# EAGLE design hermesONE Mini (EAGLE 9.4.2)
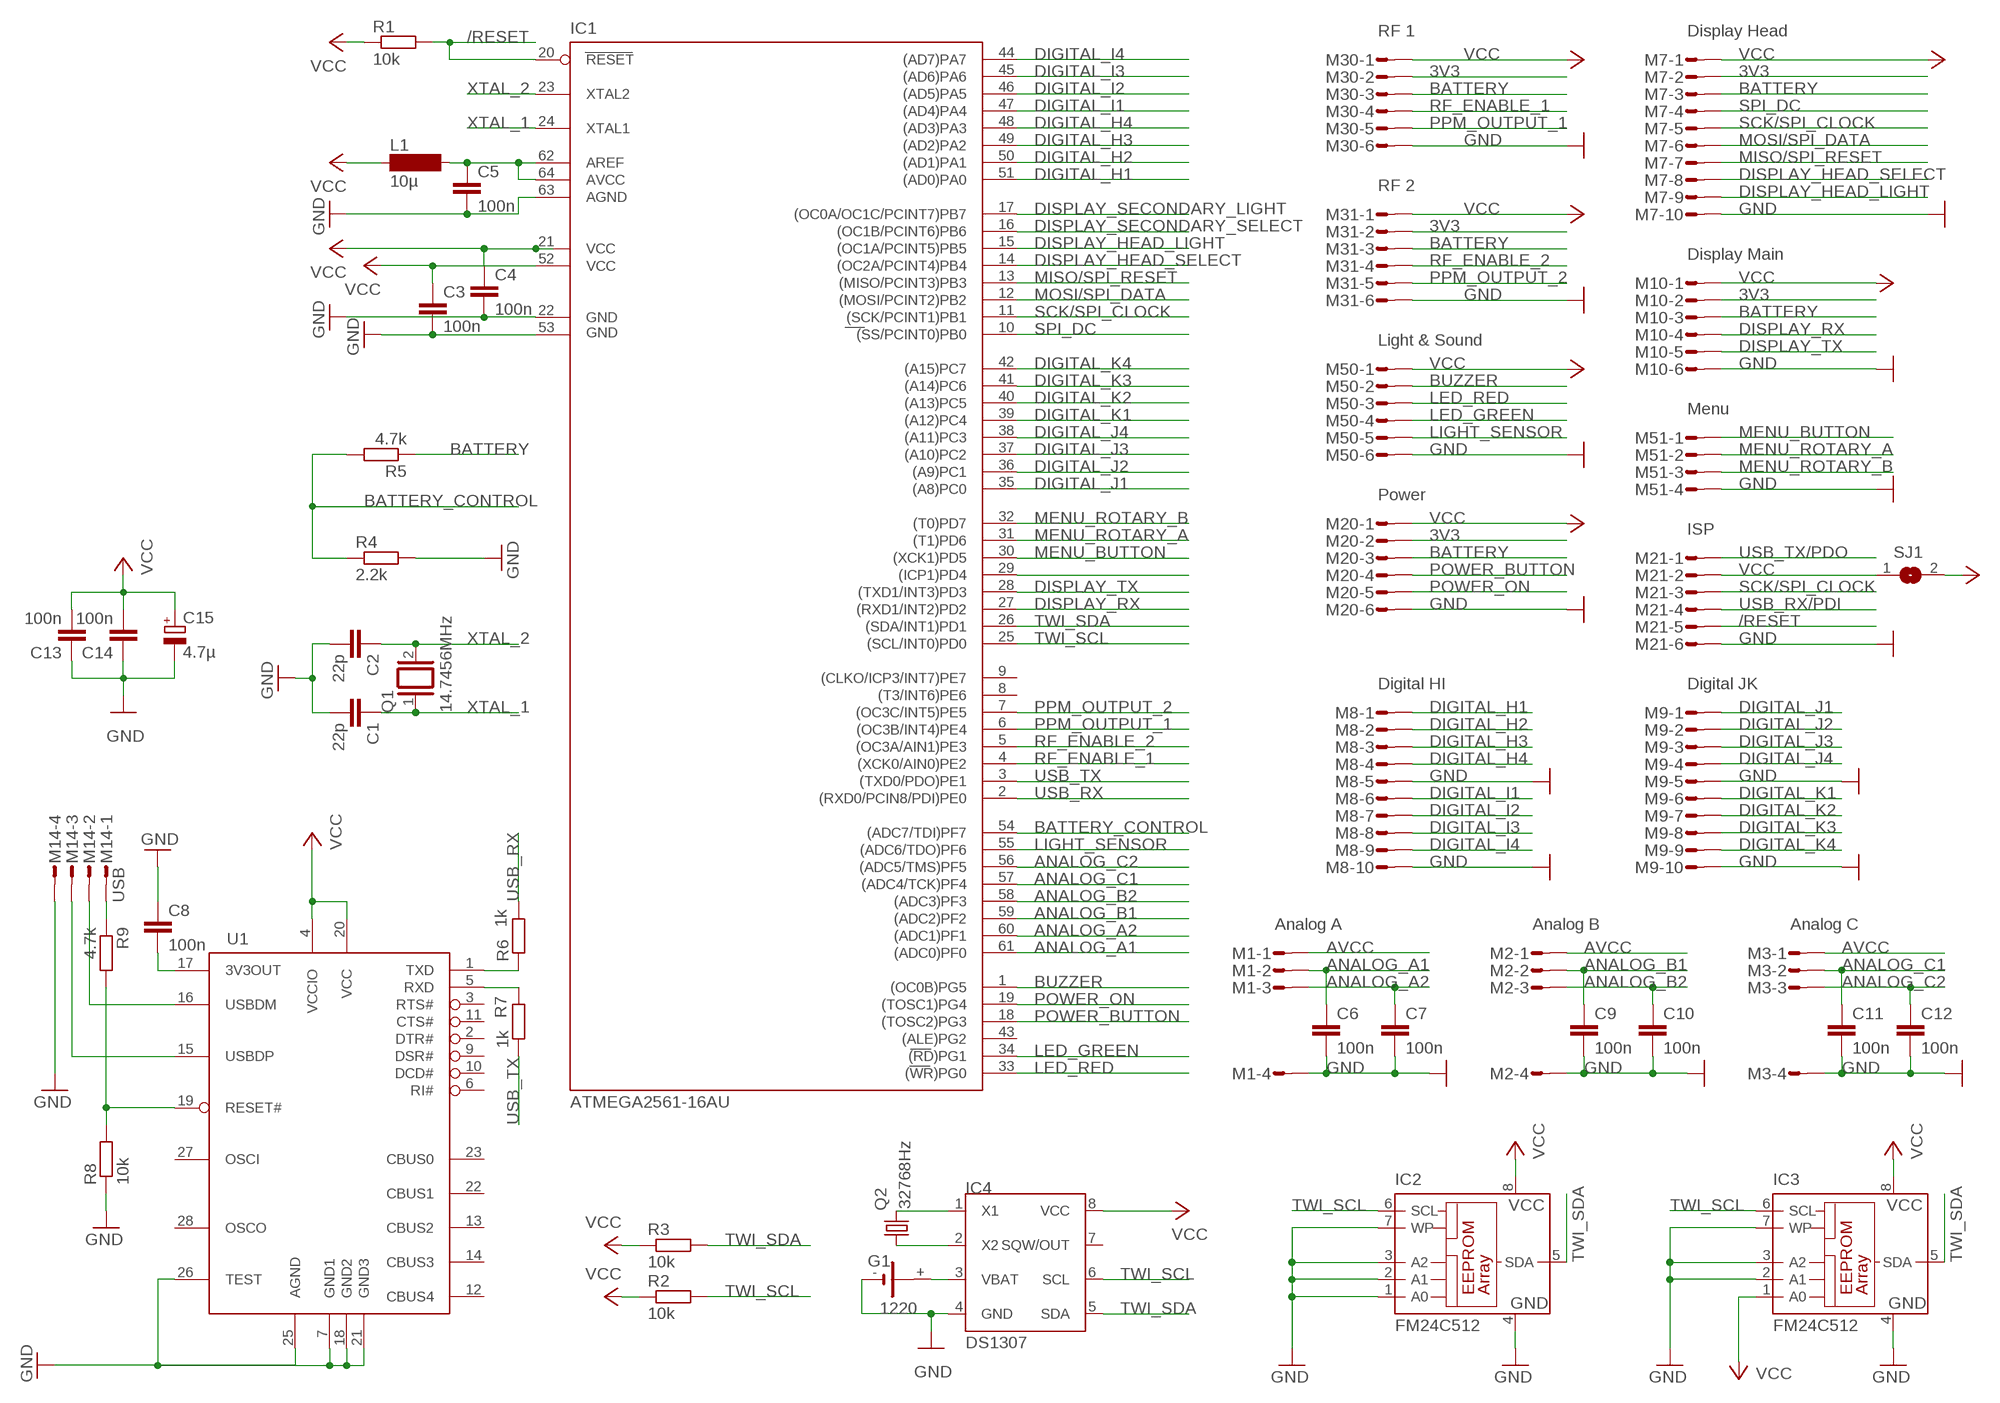
[diagram p0: schematic, sheet 1]

## Parts
C1  22p  C-EUC0603  [C0603]
C2  22p  C-EUC0603  [C0603]
C3  100n  C-EUC0603  [C0603]
C4  100n  C-EUC0603  [C0603]
C5  100n  C-EUC0603  [C0603]
C6  100n  C-EUC0603  [C0603]
C7  100n  C-EUC0603  [C0603]
C8  100n  C-EUC0603  [C0603]
C9  100n  C-EUC0603  [C0603]
C10  100n  C-EUC0603  [C0603]
C11  100n  C-EUC0603  [C0603]
C12  100n  C-EUC0603  [C0603]
C13  100n  C-EUC0603  [C0603]
C14  100n  C-EUC0603  [C0603]
C15  4.7µ  CPOL-EUB  [PANASONIC_B]
G1  1220  [KZH12THM]
IC1  ATMEGA2561-16AU  [TQFP64]
IC2  FM24C512  24C64SM  [SO-08M]
IC3  FM24C512  24C64SM  [SO-08M]
IC4  DS1307  [SOIC-8]
L1  10µ  SM-1206  [SM-1206]
M1  Analog A  MT-4  [MT-4]
M2  Analog B  MT-4  [MT-4]
M3  Analog C  MT-4  [MT-4]
M7  Display Head  MT-10  [MT-10]
M8  Digital HI  MT-10  [MT-10]
M9  Digital JK  MT-10  [MT-10]
M10  Display Main  MT-6  [MT-6]
M14  USB  MT-4  [MT-4]
M20  Power  MT-6  [MT-6]
M21  ISP  MT-6  [MT-6]
M30  RF 1  MT-6  [MT-6]
M31  RF 2  MT-6  [MT-6]
M50  Light & Sound  MT-6  [MT-6]
M51  Menu  MT-4  [MT-4]
Q1  14.7456MHz  XTAL/S  [QS]
Q2  32768Hz  CRYSTALTC26H  [TC26H]
R1  10k  R-EU_R0603  [R0603]
R2  10k  R-EU_R0603  [R0603]
R3  10k  R-EU_R0603  [R0603]
R4  2.2k  R-EU_R0603  [R0603]
R5  4.7k  R-EU_R0603  [R0603]
R6  1k  R-EU_R0603  [R0603]
R7  1k  R-EU_R0603  [R0603]
R8  10k  R-EU_R0603  [R0603]
R9  4.7k  R-EU_R0603  [R0603]
SJ1  SJ  [SJ]
U1  FT232RL  [SSOP28DB]

## Nets
3V3: M7.2 M10.2 M20.2 M30.2 M31.2
/RESET: IC1.20(RESET) M21.5 R1.2
ANALOG_A1: C6.1 IC1.61((ADC0)PF0) M1.2
ANALOG_A2: C7.1 IC1.60((ADC1)PF1) M1.3
ANALOG_B1: C9.1 IC1.59((ADC2)PF2) M2.2
ANALOG_B2: C10.1 IC1.58((ADC3)PF3) M2.3
ANALOG_C1: C11.1 IC1.57((ADC4/TCK)PF4) M3.2
ANALOG_C2: C12.1 IC1.56((ADC5/TMS)PF5) M3.3
AVCC: M1.1 M2.1 M3.1
BATTERY: M7.3 M10.3 M20.3 M30.3 M31.3 R5.1
BATTERY_CONTROL: IC1.54((ADC7/TDI)PF7) R4.1 R5.2
BUZZER: IC1.1((OC0B)PG5) M50.2
DIGITAL_H1: IC1.51((AD0)PA0) M8.1
DIGITAL_H2: IC1.50((AD1)PA1) M8.2
DIGITAL_H3: IC1.49((AD2)PA2) M8.3
DIGITAL_H4: IC1.48((AD3)PA3) M8.4
DIGITAL_I1: IC1.47((AD4)PA4) M8.6
DIGITAL_I2: IC1.46((AD5)PA5) M8.7
DIGITAL_I3: IC1.45((AD6)PA6) M8.8
DIGITAL_I4: IC1.44((AD7)PA7) M8.9
DIGITAL_J1: IC1.35((A8)PC0) M9.1
DIGITAL_J2: IC1.36((A9)PC1) M9.2
DIGITAL_J3: IC1.37((A10)PC2) M9.3
DIGITAL_J4: IC1.38((A11)PC3) M9.4
DIGITAL_K1: IC1.39((A12)PC4) M9.6
DIGITAL_K2: IC1.40((A13)PC5) M9.7
DIGITAL_K3: IC1.41((A14)PC6) M9.8
DIGITAL_K4: IC1.42((A15)PC7) M9.9
DISPLAY_HEAD_LIGHT: IC1.15((OC1A/PCINT5)PB5) M7.9
DISPLAY_HEAD_SELECT: IC1.14((OC2A/PCINT4)PB4) M7.8
DISPLAY_RX: IC1.27((RXD1/INT2)PD2) M10.4
DISPLAY_SECONDARY_LIGHT: IC1.17((OC0A/OC1C/PCINT7)PB7)
DISPLAY_SECONDARY_SELECT: IC1.16((OC1B/PCINT6)PB6)
DISPLAY_TX: IC1.28((TXD1/INT3)PD3) M10.5
GND: C1.2 C2.2 C3.2 C4.2 C5.2 C6.2 C7.2 C8.1 C9.2 C10.2 C11.2 C12.2 C13.1 C14.1 C15.- G1.- IC1.22(GND) IC1.53(GND1) IC1.63(AGND) IC2.1(A0) IC2.2(A1) IC2.3(A2) IC2.4(GND) IC2.7(WP) IC3.2(A1) IC3.3(A2) IC3.4(GND) IC3.7(WP) IC4.4(GND) M1.4 M2.4 M3.4 M7.10 M8.5 M8.10 M9.5 M9.10 M10.6 M14.4 M20.6 M21.6 M30.6 M31.6 M50.6 M51.4 R4.2 R8.1 U1.7(GND1) U1.18(GND2) U1.21(GND3) U1.25(AGND) U1.26(TEST)
LED_GREEN: IC1.34((RD)PG1) M50.4
LED_RED: IC1.33((WR)PG0) M50.3
LIGHT_SENSOR: IC1.55((ADC6/TDO)PF6) M50.5
MENU_BUTTON: IC1.30((XCK1)PD5) M51.1
MENU_ROTARY_A: IC1.31((T1)PD6) M51.2
MENU_ROTARY_B: IC1.32((T0)PD7) M51.3
MISO/SPI_RESET: IC1.13((MISO/PCINT3)PB3) M7.7
MOSI/SPI_DATA: IC1.12((MOSI/PCINT2)PB2) M7.6
N$1: M14.3 U1.15(USBDP)
N$2: G1.+ IC4.3(VBAT)
N$3: IC4.2(X2) Q2.1
N$4: M14.2 U1.16(USBDM)
N$5: C5.1 IC1.62(AREF) IC1.64(AVCC) L1.2
N$6: IC4.1(X1) Q2.2
N$7: M21.2 SJ1.1
N$8: R6.1 U1.1(TXD)
N$9: R7.1 U1.5(RXD)
N$10: M14.1 R9.1
N$11: R8.2 R9.2 U1.19(RESET#)
N$56: C8.2 U1.17(3V3OUT)
POWER_BUTTON: IC1.18((TOSC2)PG3) M20.4
POWER_ON: IC1.19((TOSC1)PG4) M20.5
PPM_INPUT: IC1.29((ICP1)PD4)
PPM_OUTPUT_1: IC1.6((OC3B/INT4)PE4) M30.5
PPM_OUTPUT_2: IC1.7((OC3C/INT5)PE5) M31.5
RF_ENABLE_1: IC1.4((XCK0/AIN0)PE2) M30.4
RF_ENABLE_2: IC1.5((OC3A/AIN1)PE3) M31.4
SCK/SPI_CLOCK: IC1.11((SCK/PCINT1)PB1) M7.5 M21.3
SPI_DC: IC1.10((SS/PCINT0)PB0) M7.4
TWI_SCL: IC1.25((SCL/INT0)PD0) IC2.6(SCL) IC3.6(SCL) IC4.6(SCL) R2.2
TWI_SDA: IC1.26((SDA/INT1)PD1) IC2.5(SDA) IC3.5(SDA) IC4.5(SDA) R3.2
USB_RX: IC1.2((RXD0/PCIN8/PDI)PE0) R6.2
USB_RX/PDI: M21.4
USB_TX: IC1.3((TXD0/PDO)PE1) R7.2
USB_TX/PDO: M21.1
VCC: C3.1 C4.1 C13.2 C14.2 C15.+ IC1.21(VCC) IC1.52(VCC1) IC2.8(VCC) IC3.1(A0) IC3.8(VCC) IC4.8(VCC) L1.1 M7.1 M10.1 M20.1 M30.1 M31.1 M50.1 R1.1 R2.1 R3.1 SJ1.2 U1.4(VCCIO) U1.20(VCC)
XTAL_1: C1.1 IC1.24(XTAL1) Q1.1
XTAL_2: C2.1 IC1.23(XTAL2) Q1.2
Unconnected: IC1.8((T3/INT6)PE6) IC1.9((CLKO/ICP3/INT7)PE7) IC1.43((ALE)PG2) IC4.7(SQW/OUT) U1.2(DTR#) U1.3(RTS#) U1.6(RI#) U1.9(DSR#) U1.10(DCD#) U1.11(CTS#) U1.12(CBUS4) U1.13(CBUS2) U1.14(CBUS3) U1.22(CBUS1) U1.23(CBUS0) U1.27(OSCI) U1.28(OSCO)

## Library data of the parts
C1-C14 = rcl:C-EU: CAPACITOR, European symbol; SPICEPREFIX: C
C15 = rcl:CPOL-EU: POLARIZED CAPACITOR, European symbol; SPICEPREFIX: C
G1 = kzh12_lithium_batterie_holder:1220
IC1 = atmel-2005:ATMEGA2561*: MICROCONTROLLER 256 Kbytes FLASH 4 Kbytes EEPROM 8 Kbytes SRAM 54 General Purpose I/O pins 6-channels 16-bit PWM 2 x Serial USARTs 8-channels 10-bit A/D
IC2 IC3 = microchip:24*: Serial EEPROM I2C
IC4 = dallas:DS1307: I2C Serial RTC w/56 bytes battery backed RAM
L1 = inductor-neosid:SM-1206: INDUCTOR SMD chip inductor
M1-M3 M14 M51 = pst-con-amp-micromatch:MT-4: MT 4 7-215079-4 / 0-215079-4; MPN: 7-215079-4
M7-M9 = pst-con-amp-micromatch:MT-10: MT 10 8-215079-0 / 1-215079-0; MF: FARNELL; MPN: 8-215079-0
M10 M20 M21 M30 M31 M50 = pst-con-amp-micromatch:MT-6: MT 6 7-215079-6 / 0-215079-6; MPN: 7-215079-6
Q1 = special:XTAL/S: CRYSTAL
Q2 = crystal:CRYSTAL: CRYSTAL
R1-R9 = rcl:R-EU_: RESISTOR, European symbol; SPICEPREFIX: R
SJ1 = jumper:SJ: SMD solder JUMPER
U1 = ftdichip-5:FT232RL: USB UART 4th Generation USB UART (USB <-> Serial) Controller

## Net classes
0 default: width 0.254 mm

## Board
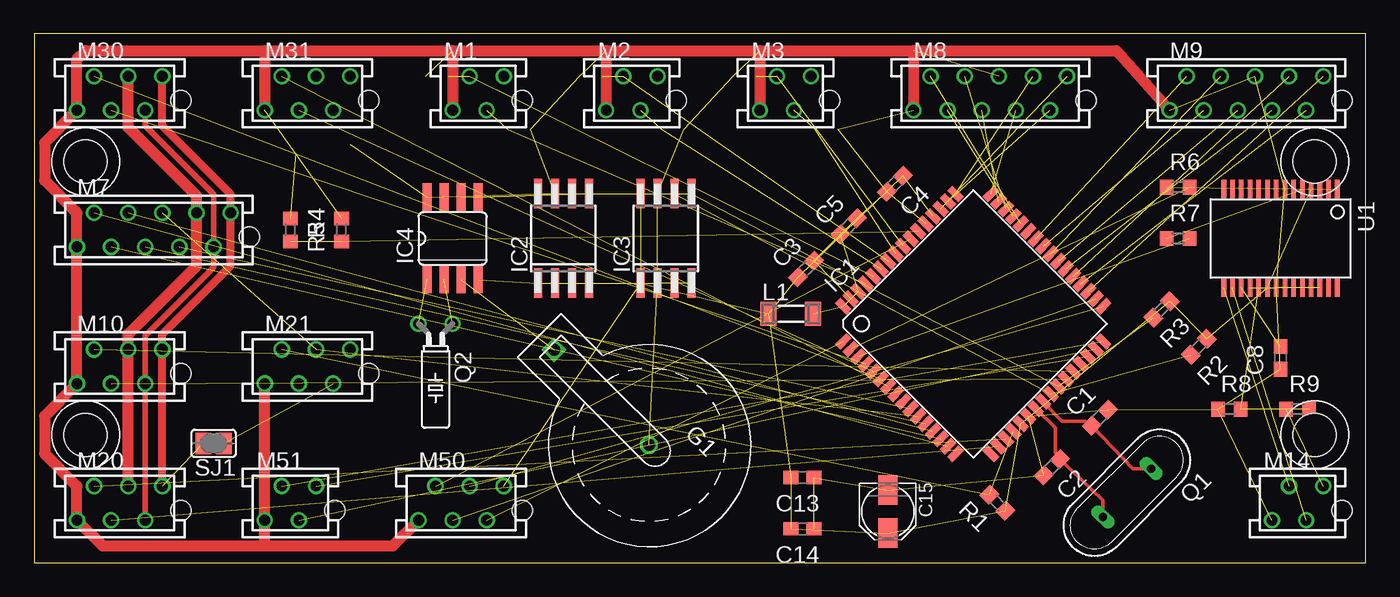
[diagram p1: board, top side]
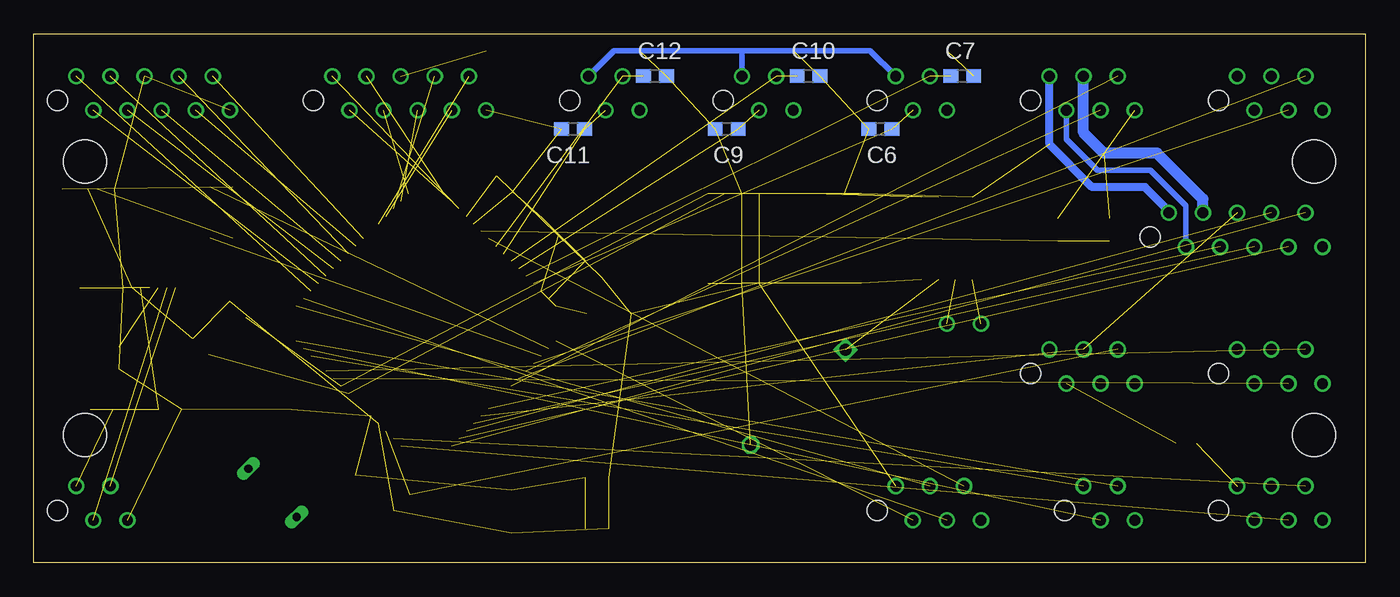
[diagram p2: board, bottom side, seen from below]

Size 99.06 x 39.36 mm. Coordinates in mm from the lower left corner, seen from the top.
Outline: 0,0 99.06,0 99.06,39.36 0,39.36 0,0
Copper layers (1*16): Top 0.035mm / dielectric 1.5mm / Bottom 0.035mm
Design rules "PCB-POOL Standard": minimum track width 0.15mm, minimum drill 0.3mm, track to track 0.15mm, track to pad 0.15mm, pad to pad 0.15mm, via to via 0.15mm, smd to smd 0.15mm, copper to edge 0.3mm, drill to drill 0.2mm, minimum pad ring 0.2mm, minimum via ring 0.15mm, stop-mask expansion 0.075mm, vias tented up to drill 0mil, thermal gap 0.2mm
Holes 3.2 mm at 3.81,9.53 95.25,9.53 95.25,29.84 3.81,29.84

### Footprints (pad centres in the part's own frame; a part is rotated, then mirrored left to right if it is on the bottom)
C0603 = smd 1.1 x 1: 1 -0.85,0; 2 0.85,0
PANASONIC_B = smd 2.2 x 1.4: + 1.6,0; - -1.6,0
KZH12THM = drill 0.9 square: + 9.982,0 | drill 0.9 octagon: - 0,0
TQFP64 = smd 1.194 x 0.559: 1 -7.76,5.905; 2 -7.76,5.118; 3 -7.76,4.331; 4 -7.76,3.543; 5 -7.76,2.756; 6 -7.76,1.968; 7 -7.76,1.181; 8 -7.76,0.394; 9 -7.76,-0.394; 10 -7.76,-1.181; 11 -7.76,-1.968; 12 -7.76,-2.756; 13 -7.76,-3.543; 14 -7.76,-4.331; 15 -7.76,-5.118; 16 -7.76,-5.905; 33 7.76,-5.905; 34 7.76,-5.118; 35 7.76,-4.331; 36 7.76,-3.543; 37 7.76,-2.756; 38 7.76,-1.968; 39 7.76,-1.181; 40 7.76,-0.394; 41 7.76,0.394; 42 7.76,1.181; 43 7.76,1.968; 44 7.76,2.756; 45 7.76,3.543; 46 7.76,4.331; 47 7.76,5.118; 48 7.76,5.905 | smd 0.559 x 1.194: 17 -5.905,-7.76; 18 -5.118,-7.76; 19 -4.331,-7.76; 20 -3.543,-7.76; 21 -2.756,-7.76; 22 -1.968,-7.76; 23 -1.181,-7.76; 24 -0.394,-7.76; 25 0.394,-7.76; 26 1.181,-7.76; 27 1.968,-7.76; 28 2.756,-7.76; 29 3.543,-7.76; 30 4.331,-7.76; 31 5.118,-7.76; 32 5.905,-7.76; 49 5.905,7.76; 50 5.118,7.76; 51 4.331,7.76; 52 3.543,7.76; 53 2.756,7.76; 54 1.968,7.76; 55 1.181,7.76; 56 0.394,7.76; 57 -0.394,7.76; 58 -1.181,7.76; 59 -1.968,7.76; 60 -2.756,7.76; 61 -3.543,7.76; 62 -4.331,7.76; 63 -5.118,7.76; 64 -5.905,7.76
SO-08M = smd 0.6 x 2.2: 1 -1.905,-3.33; 2 -0.635,-3.33; 3 0.635,-3.33; 4 1.905,-3.33; 5 1.905,3.33; 6 0.635,3.33; 7 -0.635,3.33; 8 -1.905,3.33
SOIC-8 = smd 2.032 x 0.66: 1 -3.073,1.27; 2 -3.073,0; 3 -3.073,-1.27; 4 -3.073,-2.54; 5 3.073,-2.54; 6 3.073,-1.27; 7 3.073,0; 8 3.073,1.27
SM-1206 = smd 1.2 x 1.8: 1 -1.65,0; 2 1.65,0
MT-4 = drill 0.8: 1 1.905,1.27; 2 0.635,-1.27; 3 -0.635,1.27; 4 -1.905,-1.27 | hole 1.5: 3.302,-0.533
MT-10 = drill 0.813: 1 5.715,1.27; 2 4.445,-1.27; 3 3.175,1.27; 4 1.905,-1.27; 5 0.635,1.27; 6 -0.635,-1.27; 7 -1.905,1.27; 8 -3.175,-1.27; 9 -4.445,1.27; 10 -5.715,-1.27 | hole 1.5: 7.112,-0.533
MT-6 = drill 0.813: 1 3.175,1.27; 2 1.905,-1.27; 3 0.635,1.27; 4 -0.635,-1.27; 5 -1.905,1.27; 6 -3.175,-1.27 | hole 1.5: 4.572,-0.533
QS = drill 0.61 long: 1 -2.54,0; 2 2.54,0
TC26H = drill 0.813: 1 -1.27,0; 2 1.27,0
R0603 = smd 1 x 1.1: 1 -0.85,0; 2 0.85,0
SJ = smd 1.168 x 1.6: 1 -0.762,0; 2 0.762,0
SSOP28DB = smd 0.348 x 1.397: 1 -4.225,-3.656; 2 -3.575,-3.656; 3 -2.925,-3.656; 4 -2.275,-3.656; 5 -1.625,-3.656; 6 -0.975,-3.656; 7 -0.325,-3.656; 8 0.325,-3.656; 9 0.975,-3.656; 10 1.625,-3.656; 11 2.275,-3.656; 12 2.925,-3.656; 13 3.575,-3.656; 14 4.225,-3.656; 15 4.225,3.656; 16 3.575,3.656; 17 2.925,3.656; 18 2.275,3.656; 19 1.625,3.656; 20 0.975,3.656; 21 0.325,3.656; 22 -0.325,3.656; 23 -0.975,3.656; 24 -1.625,3.656; 25 -2.275,3.656; 26 -2.925,3.656; 27 -3.575,3.656; 28 -4.225,3.656

### Placement (x,y rotation side)
C1  79.26,10.8 45 top
C2  75.7,7.12 225 top
C3  57.41,21.85 45 top
C4  64.03,28.2 225 top
C5  60.59,25.03 45 top
C6  36.07,32.26 180 bottom
C7  29.97,36.2 0 bottom
C8  92.71,15.24 90 top
C9  47.5,32.26 180 bottom
C10  41.4,36.2 0 bottom
C11  58.93,32.26 180 bottom
C12  52.83,36.2 0 bottom
C13  57.15,6.35 180 top
C14  57.15,2.54 180 top
C15  63.5,3.81 270 top
G1  45.72,8.78 135 top
IC1  69.85,17.78 45 top
IC2  39.37,24.13 0 top
IC3  46.99,24.13 0 top
IC4  30.48,24.13 90 top
L1  56.28,18.53 0 top
M1  33.02,34.92 0 top
M2  44.45,34.92 0 top
M3  55.88,34.92 0 top
M7  8.89,24.77 0 top
M8  71.12,34.92 0 top
M9  90.17,34.92 0 top
M10  6.35,14.61 0 top
M14  93.98,4.45 0 top
M20  6.35,4.45 0 top
M21  20.32,14.61 0 top
M30  6.35,34.92 0 top
M31  20.32,34.92 0 top
M50  31.75,4.45 0 top
M51  19.05,4.45 0 top
Q1  81.29,5.22 225 top
Q2  29.84,17.78 180 top
R1  71.65,4.46 135 top
R2  86.63,16.07 225 top
R3  83.86,18.85 225 top
R4  22.86,24.77 90 top
R5  19.05,24.77 270 top
R6  85.09,27.94 0 top
R7  85.09,24.13 0 top
R8  88.9,11.43 0 top
R9  93.98,11.43 0 top
SJ1  13.34,8.89 180 top
U1  92.71,24.13 180 top

### Tracks (layer width: path | path; a pad name or v marks a point on that pad's centre or on a via)
3V3
  Top 0.406: M20.2 M10.2 8.26,16.89 13.34,21.97 M7.2 13.34,27.43 8.26,32.51 M30.2
  Bottom 0.406: M31.2 22.23,31.5 19.94,29.21 16,29.21 13.34,26.54 M7.2
/RESET  (2 unrouted)
ANALOG_A1  (2 unrouted)
ANALOG_A2  (2 unrouted)
ANALOG_B1  (2 unrouted)
ANALOG_B2  (2 unrouted)
ANALOG_C1  (2 unrouted)
ANALOG_C2  (2 unrouted)
AVCC
  Bottom 0.406: M1.1 36.83,38.1 46.23,38.1 | 46.23,38.1 55.88,38.1 M3.1 | M2.1 46.35,37.97 46.23,38.1
BATTERY  (1 unrouted)
  Top 0.813: M20.3 M10.3 6.99,17.02 12.06,22.1 M7.3 12.06,27.3 6.99,32.38 M30.3
  Bottom 0.813: M7.3 12.06,27.05 15.49,30.48 19.43,30.48 20.95,32 M31.3
BATTERY_CONTROL  (2 unrouted)
BUZZER  (1 unrouted)
DIGITAL_H1  (1 unrouted)
DIGITAL_H2  (1 unrouted)
DIGITAL_H3  (1 unrouted)
DIGITAL_H4  (1 unrouted)
DIGITAL_I1  (1 unrouted)
DIGITAL_I2  (1 unrouted)
DIGITAL_I3  (1 unrouted)
DIGITAL_I4  (1 unrouted)
DIGITAL_J1  (1 unrouted)
DIGITAL_J2  (1 unrouted)
DIGITAL_J3  (1 unrouted)
DIGITAL_J4  (1 unrouted)
DIGITAL_K1  (1 unrouted)
DIGITAL_K2  (1 unrouted)
DIGITAL_K3  (1 unrouted)
DIGITAL_K4  (1 unrouted)
DISPLAY_HEAD_LIGHT  (1 unrouted)
DISPLAY_HEAD_SELECT  (1 unrouted)
DISPLAY_RX  (1 unrouted)
DISPLAY_TX  (1 unrouted)
GND  (39 unrouted)
  Top 0.813: 17.14,38.1 31.11,38.1 | 31.11,38.1 42.55,38.1 | 42.55,38.1 53.98,38.1 | 53.98,38.1 65.41,38.1 | 65.41,38.1 80.49,38.1 M9.10 | 53.98,38.1 M3.4 | 42.55,38.1 M2.4 | 31.11,38.1 M1.4 | 65.41,38.1 M8.10 | 17.14,1.27 M51.4 M21.6 | 17.14,1.27 26.67,1.27 M50.6 | 17.14,1.27 5.08,1.27 M20.6 3.17,5.71 0.76,8.13 0.76,10.92 M10.6 M7.10 3.17,26.04 0.76,28.45 0.76,31.24 M30.6 3.17,37.47 3.81,38.1 17.14,38.1 | 17.14,38.1 M31.6
LED_GREEN  (1 unrouted)
LED_RED  (1 unrouted)
LIGHT_SENSOR  (1 unrouted)
MENU_BUTTON  (1 unrouted)
MENU_ROTARY_A  (1 unrouted)
MENU_ROTARY_B  (1 unrouted)
MISO/SPI_RESET  (1 unrouted)
MOSI/SPI_DATA  (1 unrouted)
N$1  (1 unrouted)
N$2  (1 unrouted)
N$3  (1 unrouted)
N$4  (1 unrouted)
N$5  (3 unrouted)
N$6  (1 unrouted)
N$7  (1 unrouted)
N$8  (1 unrouted)
N$9  (1 unrouted)
N$10  (1 unrouted)
N$11  (2 unrouted)
N$56  (1 unrouted)
POWER_BUTTON  (1 unrouted)
POWER_ON  (1 unrouted)
PPM_OUTPUT_1  (1 unrouted)
PPM_OUTPUT_2  (1 unrouted)
RF_ENABLE_1  (1 unrouted)
RF_ENABLE_2  (1 unrouted)
SCK/SPI_CLOCK  (2 unrouted)
SPI_DC  (1 unrouted)
TWI_SCL  (4 unrouted)
TWI_SDA  (4 unrouted)
USB_RX  (1 unrouted)
USB_TX  (1 unrouted)
VCC  (19 unrouted)
  Top 0.61: M30.1 9.53,32.51 14.61,27.43 M7.1 14.61,22.1 9.53,17.02 M10.1 M20.1
  Bottom 0.61: M31.1 23.5,31.11 20.32,27.94 16.38,27.94 14.61,26.16 M7.1
XTAL_1
  Top 0.254: IC1.24 75.06,11.94 76.45,10.54 78.18,10.54 C1.1 81.7,7.01 Q1.1
XTAL_2
  Top 0.254: Q1.2 79.49,4.67 C2.1 75.95,8.22 75.95,10.03 74.52,11.46 IC1.23